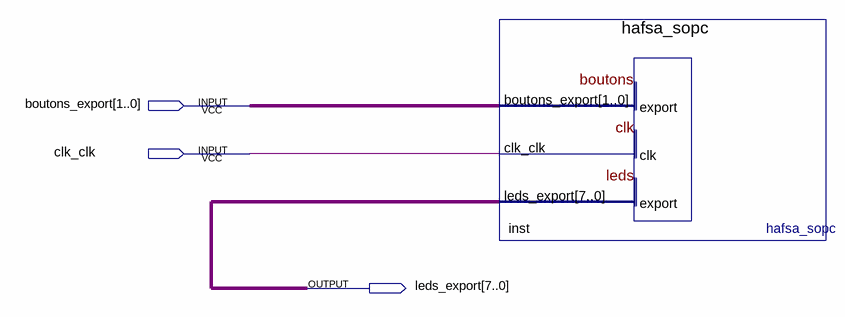
[diagram p0: schematic sheet]
// Quartus schematic sopc.bdf as structural Verilog: 1 symbols, 3 pins
module sopc (
  input  [1:0] boutons_export,
  input  clk_clk,
  output [7:0] leds_export
);

  hafsa_sopc inst (.boutons_export(boutons_export), .clk_clk(clk_clk), .leds_export(leds_export));
endmodule
